# EAGLE schematic IDP_circuit_diagram_v1 (EAGLE 9.6.2)
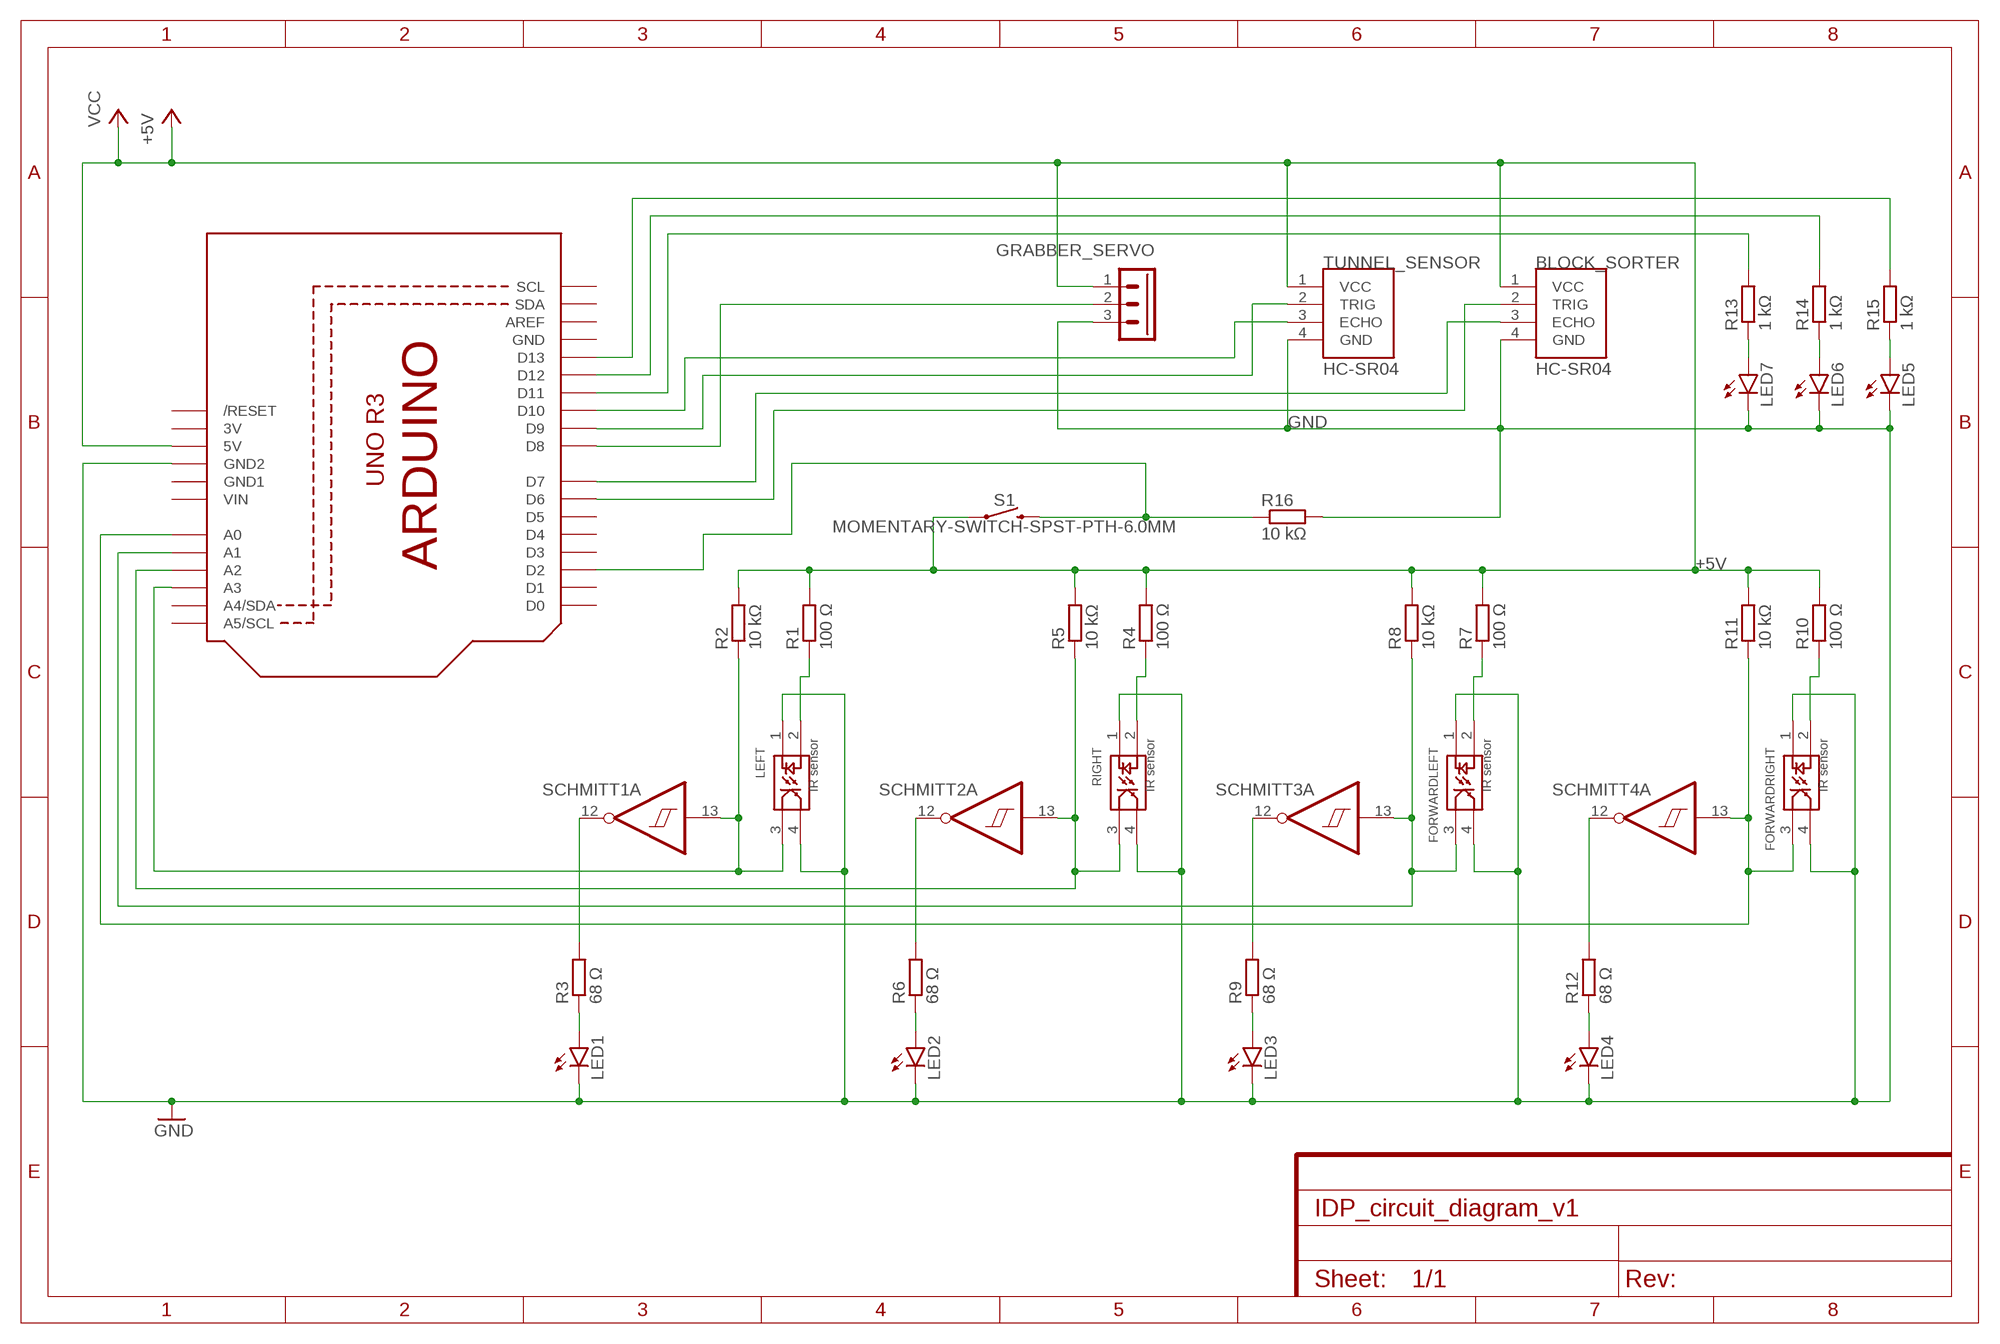
[diagram p0: schematic, sheet 1]

## Parts
BLOCK_SORTER  HC-SR04  [XCVR_HC-SR04]
FORWARDLEFT  IR sensor  OPB704  [22-23-2041]
FORWARDRIGHT  IR sensor  OPB704  [22-23-2041]
GRABBER_SERVO  22-27-2031-03  [6410-03]
LED1  LED_23MM  [LED3MM]
LED2  LED_23MM  [LED3MM]
LED3  LED_23MM  [LED3MM]
LED4  LED_23MM  [LED3MM]
LED5  LED_23MM  [LED3MM]
LED6  LED_23MM  [LED3MM]
LED7  LED_23MM  [LED3MM]
LEFT  IR sensor  OPB704  [22-23-2041]
Q1  ARDUINOR3-NOIOREF-NOTEXT  [ARDUINOR3-NOTEXT-NOIOREF]
R1  100 Ω  R-EU_0204/2V  [0204V]
R2  10 kΩ  R-EU_0204/2V  [0204V]
R3  68 Ω  R-EU_0204/2V  [0204V]
R4  100 Ω  R-EU_0204/2V  [0204V]
R5  10 kΩ  R-EU_0204/2V  [0204V]
R6  68 Ω  R-EU_0204/2V  [0204V]
R7  100 Ω  R-EU_0204/2V  [0204V]
R8  10 kΩ  R-EU_0204/2V  [0204V]
R9  68 Ω  R-EU_0204/2V  [0204V]
R10  100 Ω  R-EU_0204/2V  [0204V]
R11  10 kΩ  R-EU_0204/2V  [0204V]
R12  68 Ω  R-EU_0204/2V  [0204V]
R13  1 kΩ  R-EU_0204/2V  [0204V]
R14  1 kΩ  R-EU_0204/2V  [0204V]
R15  1 kΩ  R-EU_0204/2V  [0204V]
R16  10 kΩ  R-EU_0204/2V  [0204V]
RIGHT  IR sensor  OPB704  [22-23-2041]
S1  MOMENTARY-SWITCH-SPST-PTH-6.0MM  [TACTILE_SWITCH_PTH_6.0MM]
SCHMITT1  74HC14D  [SO14]
SCHMITT2  74HC14D  [SO14]
SCHMITT3  74HC14D  [SO14]
SCHMITT4  74HC14D  [SO14]
TUNNEL_SENSOR  HC-SR04  [XCVR_HC-SR04]

## Nets
+5V: BLOCK_SORTER.1(VCC) GRABBER_SERVO.1 Q1.5V R1.2 R2.2 R4.2 R5.2 R7.2 R8.2 R10.2 R11.2 S1.1 TUNNEL_SENSOR.1(VCC) ; supply symbol labelled VCC
GND: BLOCK_SORTER.4(GND) FORWARDLEFT.1 FORWARDLEFT.4 FORWARDRIGHT.1 FORWARDRIGHT.4 GRABBER_SERVO.3 LED1.K(C) LED2.K(C) LED3.K(C) LED4.K(C) LED5.K(C) LED6.K(C) LED7.K(C) LEFT.1 LEFT.4 Q1.GND2 R16.2 RIGHT.1 RIGHT.4 TUNNEL_SENSOR.4(GND)
N$2: LEFT.3 Q1.A3 R2.1 SCHMITT1.13(A:I)
N$3: BLOCK_SORTER.2(TRIG) Q1.D6
N$4: Q1.D2 R16.1 S1.3
N$6: GRABBER_SERVO.2 Q1.D8
N$7: Q1.D9 TUNNEL_SENSOR.2(TRIG)
N$8: Q1.D10 TUNNEL_SENSOR.3(ECHO)
N$9: BLOCK_SORTER.3(ECHO) Q1.D7
N$12: LED3.A R9.1
N$13: Q1.D11 R13.2
N$14: Q1.D12 R14.2
N$15: Q1.D13 R15.2
N$17: FORWARDRIGHT.3 Q1.A0 R11.1 SCHMITT4.13(A:I)
N$18: LED7.A R13.1
N$34: FORWARDLEFT.2 R7.1
N$35: FORWARDRIGHT.2 R10.1
N$41: LED4.A R12.1
N$43: FORWARDLEFT.3 Q1.A1 R8.1 SCHMITT3.13(A:I)
N$44: R12.2 SCHMITT4.12(A:O)
N$45: LED6.A R14.1
N$46: LED2.A R6.1
N$48: R4.1 RIGHT.2
N$49: Q1.A2 R5.1 RIGHT.3 SCHMITT2.13(A:I)
N$50: R9.2 SCHMITT3.12(A:O)
N$51: LED5.A R15.1
N$52: R6.2 SCHMITT2.12(A:O)
N$54: LED1.A R3.1
N$56: LEFT.2 R1.1
N$58: R3.2 SCHMITT1.12(A:O)
Unconnected: Q1.A4(A4/SDA) Q1.A5(A5/SCL) Q1.AREF Q1.D0 Q1.D1 Q1.D3 Q1.D4 Q1.D5 Q1.RESET(/RESET) Q1.SCL Q1.SDA SCHMITT1.1(D:I) SCHMITT1.2(D:O) SCHMITT1.3(E:I) SCHMITT1.4(E:O) SCHMITT1.5(F:I) SCHMITT1.6(F:O) SCHMITT1.8(C:O) SCHMITT1.9(C:I) SCHMITT1.10(B:O) SCHMITT1.11(B:I) SCHMITT2.1(D:I) SCHMITT2.2(D:O) SCHMITT2.3(E:I) SCHMITT2.4(E:O) SCHMITT2.5(F:I) SCHMITT2.6(F:O) SCHMITT2.8(C:O) SCHMITT2.9(C:I) SCHMITT2.10(B:O) SCHMITT2.11(B:I) SCHMITT3.1(D:I) SCHMITT3.2(D:O) SCHMITT3.3(E:I) SCHMITT3.4(E:O) SCHMITT3.5(F:I) SCHMITT3.6(F:O) SCHMITT3.8(C:O) SCHMITT3.9(C:I) SCHMITT3.10(B:O) SCHMITT3.11(B:I) SCHMITT4.1(D:I) SCHMITT4.2(D:O) SCHMITT4.3(E:I) SCHMITT4.4(E:O) SCHMITT4.5(F:I) SCHMITT4.6(F:O) SCHMITT4.8(C:O) SCHMITT4.9(C:I) SCHMITT4.10(B:O) SCHMITT4.11(B:I)

## Power pins joined to a net without a drawn wire
3V: Q1.3V
GND: Q1.GND SCHMITT1.7(P:GND) SCHMITT2.7(P:GND) SCHMITT3.7(P:GND) SCHMITT4.7(P:GND)
GND1: Q1.GND1
VCC: SCHMITT1.14(P:VCC) SCHMITT2.14(P:VCC) SCHMITT3.14(P:VCC) SCHMITT4.14(P:VCC)
VIN: Q1.VIN

## Library data of the parts
BLOCK_SORTER TUNNEL_SENSOR = IDP_library:HC-SR04: Ultrasonic Sensor Module Check prices <https://pricing.snapeda.com/parts/HC-SR04/SparkFun%20Electronics/view-part?ref=eda>; AVAILABILITY: Not in stock; DESCRIPTION: HC-SR04 Ultrasonic Sensor Qwiic Platform Evaluation Expansion Board; MF: SparkFun Electronics; MP: HC-SR04; PACKAGE: None; PRICE: None
FORWARDLEFT FORWARDRIGHT LEFT RIGHT = IDP_library:OPB704: 314020022
GRABBER_SERVO = IDP_library:22-?-03: CONNECTOR wire to board 2.54 mm (.1 inch) pitch header 3 pin Right angle and straight; MF: MOLEX; OC_FARNELL: unknown; OC_NEWARK: unknown
LED1-LED7 = IDP_library:LED_2: LED
Q1 = IDP_library:ARDUINOR3-NOIOREF
R1-R16 = IDP_library:R-EU_: RESISTOR, European symbol; SPICEPREFIX: R
S1 = SparkFun-Switches:MOMENTARY-SWITCH-SPST: Momentary Switch (Pushbutton) - SPST Normally-open (NO) SPST momentary switches (buttons, pushbuttons). Variants PTH-12MM - 12mm square, through-hole Momentary Pushbutton Switch - 12mm Square <https://www.sparkfun.com/products/9190> (COM-09190) PTH-6.0MM, PTH-6.0MM-KIT - 6.0mm square, through-hole Mini Pushbutton Switch <https://www.sparkfun.com/products/97> (COM-00097) KIT package intended for soldering kit's - only one side of pads' copper is exposed. PTH-RIGHT-ANGLE-KIT - Right-angle, through-hole Right Angle Tactile Button <https://www.sparkfun.com/products/10791> - Used on SparkFun BigTime Watch Kit <https://www.sparkfun.com/products/11734> SMD-12MM - 12mm square, surface-mount Tactile Button - SMD (12mm) <https://www.sparkfun.com/products/12993> (COM-12993) Used on SparkFun PicoBoard <https://www.sparkfun.com/products/11888> SMD-4.5MM - 4.5mm Square Trackball Switch Used on SparkFun Blackberry Trackballer Breakout <https://www.sparkfun.com/products/13169> SMD-4.6MMX2.8MM - 4.60mm x 2.80mm, surface mount Used on SparkFun SAMD21 Mini Breakout <https://www.sparkfun.com/products/13664> SMD-5.2MM, SMD-5.2-REDUNDANT - 5.2mm square, surface-mount Mini Pushbutton Switch - SMD <https://www.sparkfun.com/products/8720> (COM-08720) Used on Arduino Pro Mini <https://www.sparkfun.com/products/11114> REDUNDANT package connects both switch circuits together SMD-6.0X3.5MM - 6.0 x 3.5mm, surface mount Momentary Reset Switch SMD <https://www.sparkfun.com/products/8229> (COM-08229) SMD-6.2MM-TALL - 6.2mm square, surface mount Tactile Button - SMD (6mm) <https://www.sparkfun.com/products/12992> Used on SparkFun Digital Sandbox <https://www.sparkfun.com/products/12651> SMD-RIGHT-ANGLE - Right-angle, surface mount Used on SparkFun Block for Intel® Edison - Arduino <https://www.sparkfun.com/products/13036>; PROD_ID: SWCH-08441; SF_SKU: COM-00097
SCHMITT1-SCHMITT4 = IDP_library:74*14: Hex schmitt trigger INVERTER